# EAGLE schematic permamote (EAGLE 9.5.0)
AUTHOR: NEAL JACKSON; REV: C; TITLE: PERMAMOTE

## Sheet 1 of 5: NRF
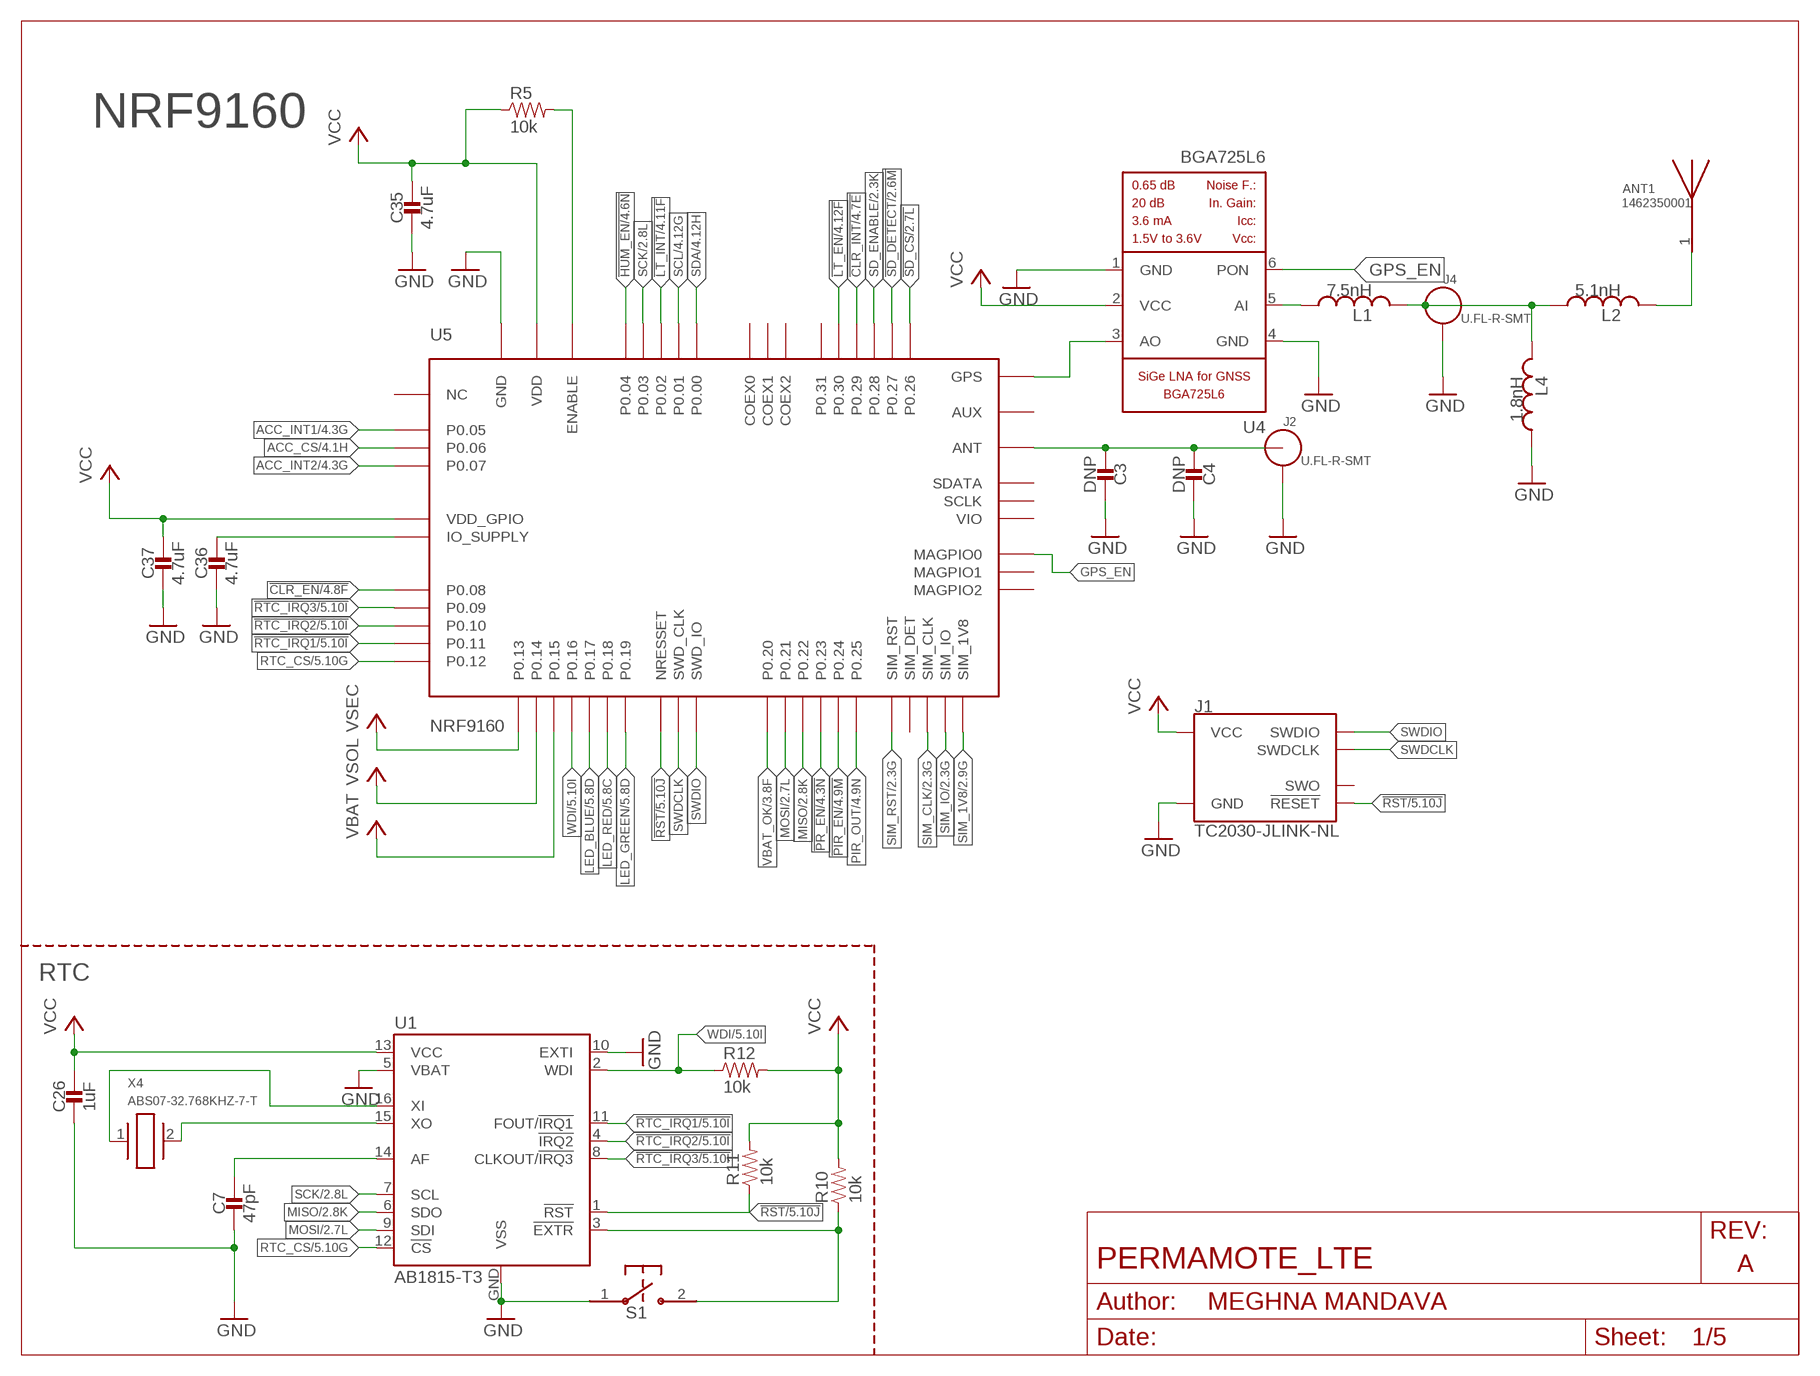
[diagram p0: schematic, sheet 1]
FRAME1 (LETTER_L_BLANK): AUTHOR: MEGHNA MANDAVA; REV: A; TITLE: PERMAMOTE_LTE

### Parts
ANT1  1462350001  [ANT_1462350001]
C3  DNP  CAPACITOR0402_CAP  [0402_CAP]
C4  DNP  CAPACITOR0402_CAP  [0402_CAP]
C7  47pF  CAPACITOR0402_CAP  [0402_CAP]
C26  1uF  CAPACITOR0402_CAP  [0402_CAP]
C35  4.7uF  CAPACITOR0402_CAP  [0402_CAP]
C36  4.7uF  CAPACITOR0402_CAP  [0402_CAP]
C37  4.7uF  CAPACITOR0402_CAP  [0402_CAP]
J1  TC2030-JLINK-NL  [TC2030-IDC-NL]
J2  U.FL-R-SMT  [U.FL_SMT]
J4  U.FL-R-SMT  [U.FL_SMT]
L1  7.5nH  INDUCTOR0402  [0402_CAP]
L2  5.1nH  INDUCTOR0402  [0402_CAP]
L4  1.8nH  INDUCTOR0402  [0402_CAP]
R5  10k  RESISTOR0402_RES  [0402_RES]
R10  10k  RESISTOR0402_RES  [0402_RES]
R11  10k  RESISTOR0402_RES  [0402_RES]
R12  10k  RESISTOR0402_RES  [0402_RES]
S1  B3U-1000P  [B3U-1000P]
U1  AB1815-T3  [QFN-16-3MM]
U4  BGA725L6  [LNA-TSLP-6-2-ORIG]
U5  NRF9160  [NRF9160]
X4  ABS07-32.768KHZ-7-T  [2-SMD]

### Nets
!CLR_EN: U5.P0.08 ; also sheet 4,5
!CLR_INT: U5.P0.29 ; also sheet 4,5
!HUM_EN: U5.P0.04 ; also sheet 4,5
!LT_EN: U5.P0.30 ; also sheet 4,5
!LT_INT: U5.P0.02 ; also sheet 4,5
!PIR_EN: U5.P0.24 ; also sheet 4,5
!PR_EN: U5.P0.23 ; also sheet 4,5
!RST: J1.3(!RESET) R11.1 U1.1(!RST) U5.NRESET(NRESSET) ; also sheet 5
!RTC_EXTR: R10.1 S1.2 U1.3(!EXTR)
!RTC_IRQ1: U1.11(FOUT/!IRQ1) U5.P0.11 ; also sheet 5
!RTC_IRQ2: U1.4(!IRQ2) U5.P0.10 ; also sheet 5
!RTC_IRQ3: U1.8(CLKOUT/!IRQ3) U5.P0.09 ; also sheet 5
!SD_CS: U5.P0.26 ; also sheet 2
!SD_DETECT: U5.P0.27 ; also sheet 2
ACC_CS: U5.P0.06 ; also sheet 4,5
ACC_INT1: U5.P0.05 ; also sheet 4,5
ACC_INT2: U5.P0.07 ; also sheet 4,5
GND: C3.1 C4.1 C7.2 C26.2 C35.2 C36.2 C37.2 J1.5(GND) J2.GND1 J2.GND2 J4.GND1 J4.GND2 L4.1 S1.1 U1.5(VBAT) U1.10(EXTI) U1.GND(VSS) U4.1(GND) U4.4(GND) U5.GND@1(GND) U5.GND@2(GND) U5.GND@3(GND) U5.GND@4(GND) U5.GND@5(GND) U5.GND@6(GND) U5.GND@7(GND) U5.GND@8(GND) U5.GND@9(GND) U5.GND@10(GND) U5.GND@11(GND) U5.GND@12(GND) U5.GND@13(GND) U5.GND@14(GND) U5.GND@15(GND) U5.GND@16(GND) U5.GND@17(GND) U5.GND@18(GND) U5.GND@19(GND) U5.GND@20(GND) U5.GND@21(GND) U5.GND@22(GND) U5.GND@23(GND) U5.GND@24(GND) U5.GND@25(GND) U5.GND@26(GND) U5.GND@27(GND) U5.GND@28(GND) U5.GND@29(GND) U5.GND@30(GND) U5.GND@31(GND) U5.GND@32(GND) U5.GND@33(GND) U5.GND@34(GND) U5.GND@35(GND) U5.GND_SHIELD@1(GND) U5.GND_SHIELD@2(GND) U5.GND_SHIELD@3(GND) U5.GND_SHIELD@4(GND) U5.GND_SHIELD@5(GND) U5.GND_SHIELD@6(GND) U5.GND_SHIELD@7(GND) U5.GND_SHIELD@8(GND) U5.GND_SHIELD@9(GND) U5.GND_SHIELD@10(GND) U5.GND_SHIELD@11(GND) U5.GND_SHIELD@12(GND) U5.GND_SHIELD@13(GND) U5.GND_SHIELD@14(GND) U5.GND_SHIELD@15(GND) U5.GND_SHIELD@16(GND) U5.GND_SHIELD@17(GND) U5.GND_SHIELD@18(GND) U5.GND_SHIELD@19(GND) U5.GND_SHIELD@20(GND) U5.GND_SHIELD@21(GND) U5.GND_SHIELD@22(GND) U5.GND_SHIELD@23(GND) U5.GND_SHIELD@24(GND) U5.GND_SHIELD@25(GND) U5.GND_SHIELD@26(GND) U5.GND_SHIELD@27(GND) U5.GND_SHIELD@28(GND) U5.GND_SHIELD@29(GND) U5.GND_SHIELD@30(GND) U5.GND_SHIELD@31(GND) U5.GND_SHIELD@32(GND) U5.GND_SHIELD@33(GND) U5.GND_SHIELD@34(GND) ; also sheet 2,3,4,5
GPS_EN: U4.6(PON) U5.MAGPIO0
LED_BLUE: U5.P0.17 ; also sheet 5
LED_GREEN: U5.P0.19 ; also sheet 5
LED_RED: U5.P0.18 ; also sheet 5
MISO: U1.6(SDO) U5.P0.22 ; also sheet 2,4,5
MOSI: U1.9(SDI) U5.P0.21 ; also sheet 2,4,5
N$1: U4.3(AO) U5.GPS
N$2: L1.1 U4.5(AI)
N$4: J4.SIG(ANT) L1.2 L2.1 L4.2
N$5: ANT1.1 L2.2
N$8: C3.2 C4.2 J2.SIG(ANT) U5.ANT
N$25: C7.1 U1.14(AF)
N$28: R5.2 U5.ENABLE
N$29: C36.1 U5.IO_SUPPLY
N$40: U1.15(XO) X4.2
N$43: U1.16(XI) X4.1
PIR_OUT: U5.P0.25 ; also sheet 4,5
RTC_CS: U1.12(!CS) U5.P0.12 ; also sheet 5
SCK: U1.7(SCL) U5.P0.03 ; also sheet 2,4,5
SCL: U5.P0.01 ; also sheet 4,5
SD_ENABLE: U5.P0.28 ; also sheet 2
SDA: U5.P0.00 ; also sheet 4,5
SIM_1V8: U5.SIM_1V8 ; also sheet 2
SIM_CLK: U5.SIM_CLK ; also sheet 2
SIM_IO: U5.SIM_IO ; also sheet 2
SIM_RST: U5.SIM_RST ; also sheet 2
SWDCLK: J1.4(SWDCLK) U5.SWDCLK(SWD_CLK)
SWDIO: J1.2(SWDIO) U5.SWDIO(SWD_IO)
VBAT: U5.P0.15 ; also sheet 3
VBAT_OK: U5.P0.20 ; also sheet 3
VCC: C26.1 C35.1 C37.1 J1.1(VCC) R5.1 R10.2 R11.2 R12.2 U1.13(VCC) U4.2(VCC) U5.VDD@1(VDD) U5.VDD@2(VDD) U5.VDD_GPIO ; also sheet 2,3,4,5
VSEC: U5.P0.13 ; also sheet 3
VSOL: U5.P0.14 ; also sheet 3,5
WDI: R12.1 U1.2(WDI) U5.P0.16 ; also sheet 5
Unconnected: J1.6(SWO) U5.AUX U5.COEX0 U5.COEX1 U5.COEX2 U5.MAGPIO1 U5.MAGPIO2 U5.NC1(NC) U5.NC2(NC) U5.NC3(NC) U5.NC4(NC) U5.NC5(NC) U5.NC6(NC) U5.NC7(NC) U5.NC8(NC) U5.NC9(NC) U5.NC10(NC) U5.NC11(NC) U5.NC12(NC) U5.NC13(NC) U5.NC14(NC) U5.NC15(NC) U5.NC16(NC) U5.NC17(NC) U5.NC18(NC) U5.NC19(NC) U5.NC20(NC) U5.NC21(NC) U5.NC22(NC) U5.NC23(NC) U5.NC24(NC) U5.NC25(NC) U5.NC26(NC) U5.NC27(NC) U5.NC28(NC) U5.NC29(NC) U5.NC30(NC) U5.NC31(NC) U5.NC32(NC) U5.NC33(NC) U5.NC34(NC) U5.NC35(NC) U5.P0.31 U5.SCLK U5.SDATA U5.SIM_DET U5.VIO

### Notes on the sheet
- NRF9160
- RTC

## Sheet 2 of 5: SIM and SD
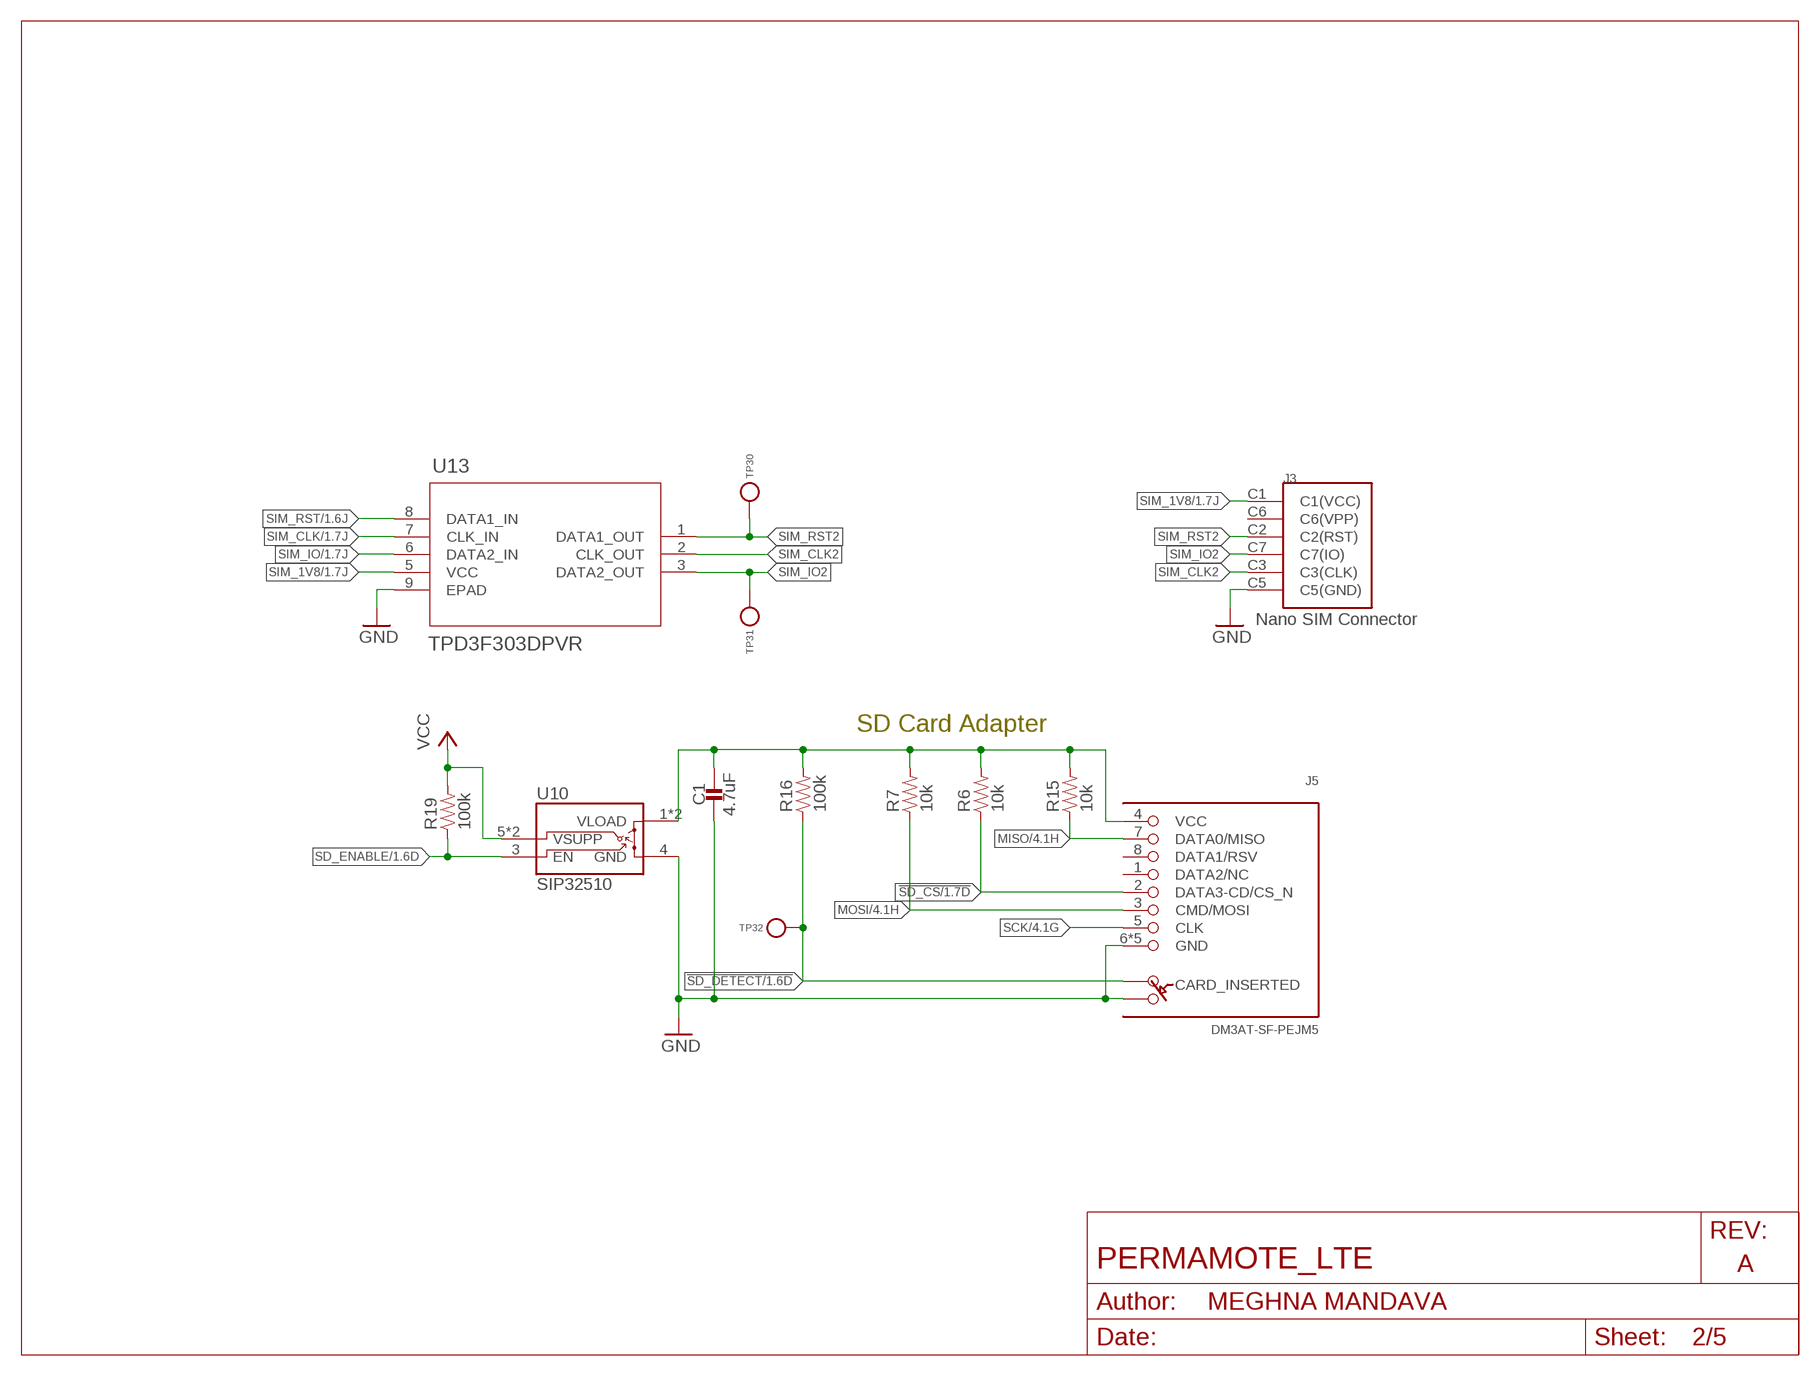
[diagram p1: schematic, sheet 2]
FRAME4 (LETTER_L_BLANK): AUTHOR: MEGHNA MANDAVA; REV: A; TITLE: PERMAMOTE_LTE

### Parts
C1  4.7uF  CAPACITOR0402_CAP  [0402_CAP]
J3  NANO_SIM  [WURTH_NANO_SIM]
J5  DM3AT-SF-PEJM5  [DM3AT-SF-PEJM5]
R6  10k  RESISTOR0402_RES  [0402_RES]
R7  10k  RESISTOR0402_RES  [0402_RES]
R15  10k  RESISTOR0402_RES  [0402_RES]
R16  100k  RESISTOR0402_RES  [0402_RES]
R19  100k  RESISTOR0402_RES  [0402_RES]
TP30  TEST-POINT  [PAD.03X.03]
TP31  TEST-POINT  [PAD.03X.03]
TP32  TEST-POINT  [PAD.03X.03]
U10  SIP32510  [TSOT23-6]
U13  TPD3F303DPVR  [DPV8_1P7X0P4]

### Nets
!SD_CS: J5.2(DATA3-CD/CS_N) R6.1 ; also sheet 1
!SD_DETECT: J5.A R16.1 TP32.P$1(TESTPOINT) ; also sheet 1
GND: C1.2 J3.C5(C5(GND)) J5.6(GND) J5.B J5.MOUNT0(GND) J5.MOUNT1(GND) J5.MOUNT2(GND) J5.MOUNT3(GND) U10.4(GND) U13.9(EPAD) ; also sheet 1,3,4,5
MISO: J5.7(DATA0/MISO) R15.1 ; also sheet 1,4,5
MOSI: J5.3(CMD/MOSI) R7.1 ; also sheet 1,4,5
N$13: C1.1 J5.4(VCC) R6.2 R7.2 R15.2 R16.2 U10.1(VLOAD) U10.2(VLOAD)
SCK: J5.5(CLK) ; also sheet 1,4,5
SD_ENABLE: R19.1 U10.3(EN) ; also sheet 1
SIM_1V8: J3.C1(C1(VCC)) U13.5(VCC) ; also sheet 1
SIM_CLK: U13.7(CLK_IN) ; also sheet 1
SIM_CLK2: J3.C3(C3(CLK)) U13.2(CLK_OUT)
SIM_IO: U13.6(DATA2_IN) ; also sheet 1
SIM_IO2: J3.C7(C7(IO)) TP31.P$1(TESTPOINT) U13.3(DATA2_OUT)
SIM_RST: U13.8(DATA1_IN) ; also sheet 1
SIM_RST2: J3.C2(C2(RST)) TP30.P$1(TESTPOINT) U13.1(DATA1_OUT)
VCC: R19.2 U10.5(VSUPP) U10.6(VSUPP) ; also sheet 1,3,4,5
Unconnected: J3.C6(C6(VPP)) J5.1(DATA2/NC) J5.8(DATA1/RSV)

### Notes on the sheet
- SD Card Adapter

## Sheet 3 of 5: Power supply
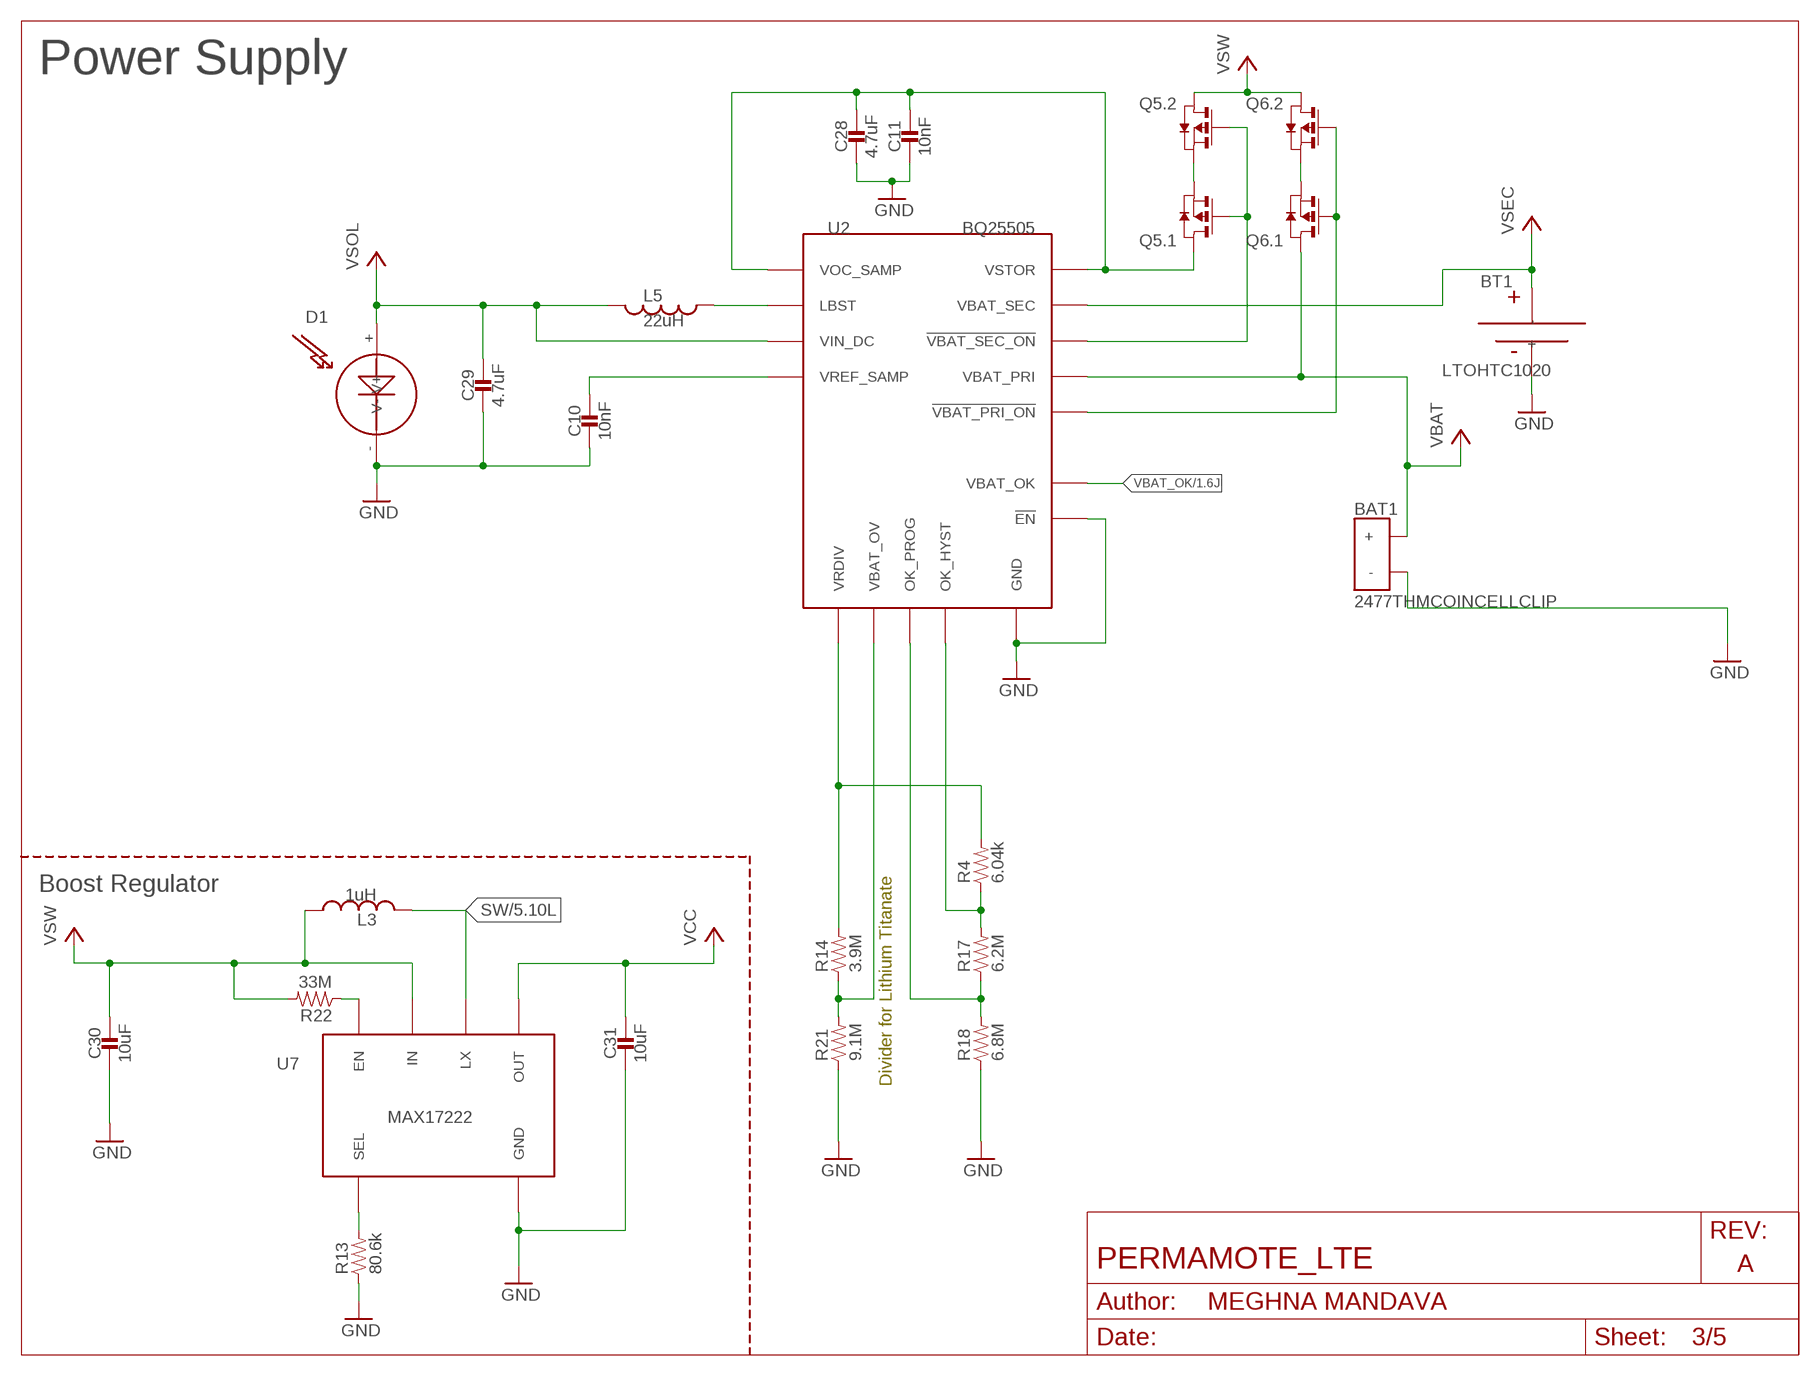
[diagram p2: schematic, sheet 3]
FRAME2 (LETTER_L_BLANK): AUTHOR: MEGHNA MANDAVA; REV: A; TITLE: PERMAMOTE_LTE

### Parts
BAT1  2477THMCOINCELLCLIP  [2477THMCOINCLIP]
BT1  LTOHTC1020  [1020]
C10  10nF  CAPACITOR0402_CAP  [0402_CAP]
C11  10nF  CAPACITOR0402_CAP  [0402_CAP]
C28  4.7uF  CAPACITOR0402_CAP  [0402_CAP]
C29  4.7uF  CAPACITOR0402_CAP  [0402_CAP]
C30  10uF  CAPACITOR0603_CAP  [0603_CAP]
C31  10uF  CAPACITOR0603_CAP  [0603_CAP]
D1  SOLARCELLHOLES  [SOLAR_HOLES]
L3  1uH  INDUCTORIHL  [IHL-1212BZ-11]
L5  22uH  INDUCTOR74437324220  [74437324220]
Q5  PMDXB950UPEL  [XDFN-6]
Q6  PMDXB950UPEL  [XDFN-6]
R4  6.04k  RESISTOR0402_RES  [0402_RES]
R13  80.6k  RESISTOR0603_RES  [0603-RES]
R14  3.9M  RESISTOR0402_RES  [0402_RES]
R17  6.2M  RESISTOR0402_RES  [0402_RES]
R18  6.8M  RESISTOR0402_RES  [0402_RES]
R21  9.1M  RESISTOR0402_RES  [0402_RES]
R22  33M  RESISTOR0603_RES  [0603-RES]
U2  BQ25505  [S-PVQFN-N20-RGR]
U7  MAX17222  [UDFN-6-MAXIM]

### Nets
!VBAT_PRI_ON: Q6.2(.1:G) Q6.5(.2:G) U2.10(!VBAT_PRI_ON)
!VBAT_SEC_ON: Q5.2(.1:G) Q5.5(.2:G) U2.9(!VBAT_SEC_ON)
GND: BAT1.GND(-) BT1.- C10.2 C11.2 C28.2 C29.2 C30.2 C31.2 D1.-(V-) R13.1 R18.1 R21.1 U2.1(GND) U2.5(!EN) U2.6(GND) U2.15(GND) U2.16(GND) U2.17(GND) U2.PAD(GND) U7.3(GND) ; also sheet 1,2,4,5
LBST: L5.P$1 U2.20(LBST)
N$12: R13.2 U7.4(SEL)
N$14: R22.1 U7.6(EN)
N$18: R14.1 R21.2 U2.7(VBAT_OV)
N$32: R4.2 R14.2 U2.8(VRDIV)
N$45: Q5.1(.1:S) Q5.4(.2:S)
N$53: Q6.1(.1:S) Q6.4(.2:S)
N$57: R17.1 R18.2 U2.12(OK_PROG)
N$58: R4.1 R17.2 U2.11(OK_HYST)
SW: L3.P$2 U7.2(LX) ; also sheet 5
VBAT: BAT1.1(+) BAT1.2(+) Q6.6(.1:D) U2.14(VBAT_PRI) ; also sheet 1
VBAT_OK: U2.13(VBAT_OK) ; also sheet 1
VCC: C31.1 U7.1(OUT) ; also sheet 1,2,4,5
VOC_SAMP_VSTOR: C11.1 C28.1 Q5.6(.1:D) U2.3(VOC_SAMP) U2.19(VSTOR)
VREF_SAMP: C10.1 U2.4(VREF_SAMP)
VSEC: BT1.+ U2.18(VBAT_SEC) ; also sheet 1
VSOL: C29.1 D1.+(V+) L5.P$2 U2.2(VIN_DC) ; also sheet 1,5
VSW: C30.1 L3.P$1 Q5.3(.2:D) Q6.3(.2:D) R22.2 U7.5(IN)

### Notes on the sheet
- Power Supply
- Boost Regulator
- Divider for Lithium Titanate

## Sheet 4 of 5: Sensors
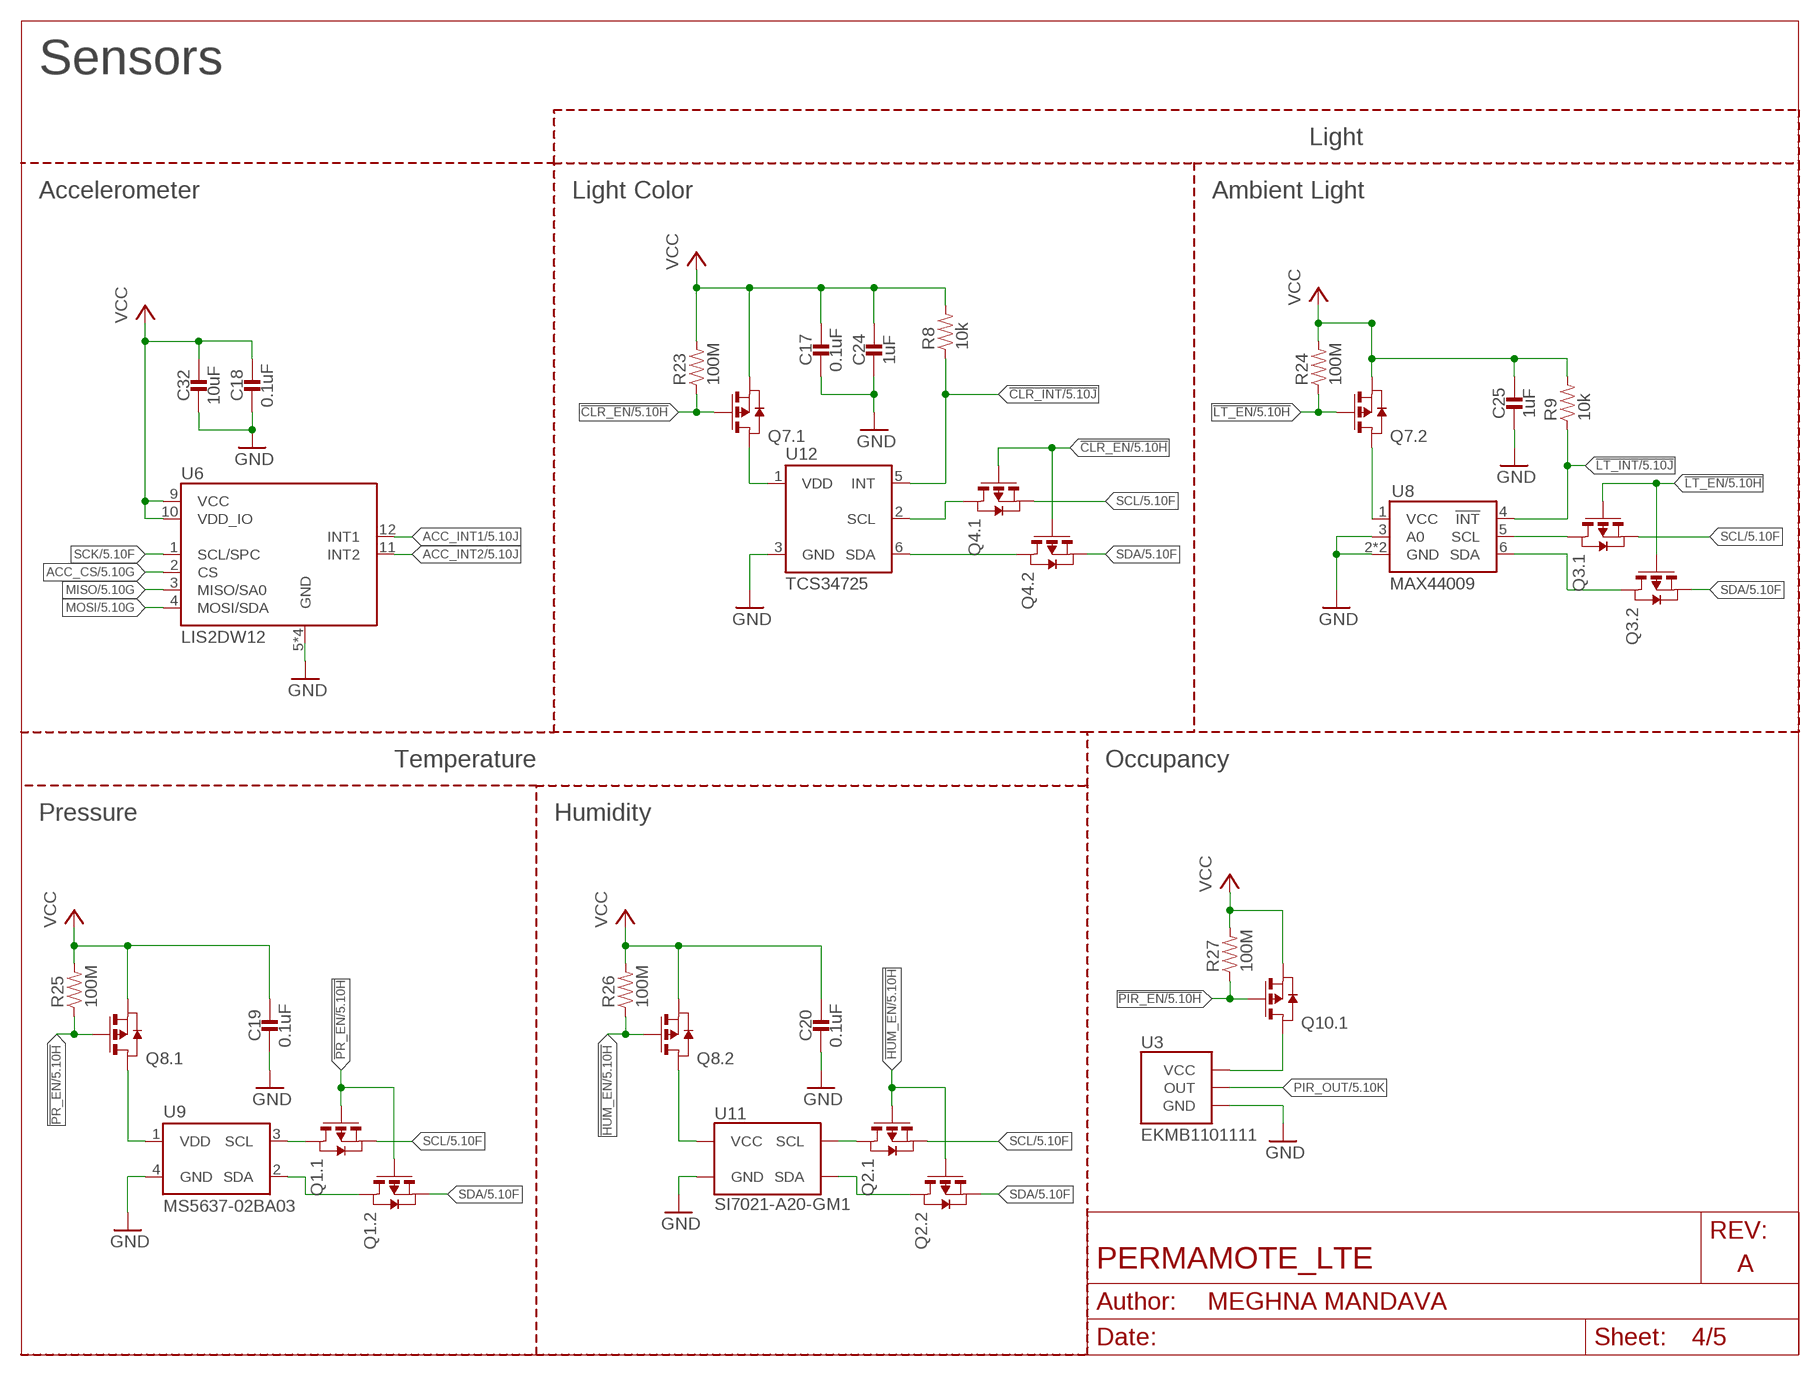
[diagram p3: schematic, sheet 4]
FRAME3 (LETTER_L_BLANK): AUTHOR: MEGHNA MANDAVA; REV: A; TITLE: PERMAMOTE_LTE

### Parts
C17  0.1uF  CAPACITOR0402_CAP  [0402_CAP]
C18  0.1uF  CAPACITOR0402_CAP  [0402_CAP]
C19  0.1uF  CAPACITOR0402_CAP  [0402_CAP]
C20  0.1uF  CAPACITOR0402_CAP  [0402_CAP]
C24  1uF  CAPACITOR0402_CAP  [0402_CAP]
C25  1uF  CAPACITOR0402_CAP  [0402_CAP]
C32  10uF  CAPACITOR0603_CAP  [0603_CAP]
Q1  PMDXB950UPEL  [XDFN-6]
Q2  PMDXB950UPEL  [XDFN-6]
Q3  PMDXB950UPEL  [XDFN-6]
Q4  PMDXB950UPEL  [XDFN-6]
Q7  PMDXB950UPEL  [XDFN-6]
Q8  PMDXB950UPEL  [XDFN-6]
Q10  PMDXB950UPEL  [XDFN-6]
R8  10k  RESISTOR0402_RES  [0402_RES]
R9  10k  RESISTOR0402_RES  [0402_RES]
R23  100M  RESISTOR0402_RES  [0402_RES]
R24  100M  RESISTOR0402_RES  [0402_RES]
R25  100M  RESISTOR0402_RES  [0402_RES]
R26  100M  RESISTOR0402_RES  [0402_RES]
R27  100M  RESISTOR0402_RES  [0402_RES]
U3  EKMB1101111  [AMN2]
U6  LIS2DW12  [LGA-12]
U8  MAX44009  [UDFN-6-EXPOSED]
U9  MS5637-02BA03  [4-SMD]
U11  SI7021-A20-GM1  [DFN-6/3MM]
U12  TCS34725  [FN-6]

### Nets
!CLR_EN: Q4.2(.1:G) Q4.5(.2:G) Q7.2(.1:G) R23.1 ; also sheet 1,5
!CLR_INT: R8.1 U12.5(INT) ; also sheet 1,5
!HUM_EN: Q2.2(.1:G) Q2.5(.2:G) Q8.5(.2:G) R26.1 ; also sheet 1,5
!LT_EN: Q3.2(.1:G) Q3.5(.2:G) Q7.5(.2:G) R24.1 ; also sheet 1,5
!LT_INT: R9.1 U8.4(!INT) ; also sheet 1,5
!PIR_EN: Q10.2(.1:G) R27.1 ; also sheet 1,5
!PR_EN: Q1.2(.1:G) Q1.5(.2:G) Q8.2(.1:G) R25.1 ; also sheet 1,5
ACC_CS: U6.2(CS) ; also sheet 1,5
ACC_INT1: U6.12(INT1) ; also sheet 1,5
ACC_INT2: U6.11(INT2) ; also sheet 1,5
GND: C17.2 C18.2 C19.2 C20.2 C24.2 C25.2 C32.2 U3.GND U6.5(GND) U6.6(GND) U6.7(GND) U6.8(GND) U8.2(GND) U8.3(A0) U8.EP(GND) U9.4(GND) U11.2(GND) U12.3(GND) ; also sheet 1,2,3,5
MISO: U6.3(MISO/SA0) ; also sheet 1,2,5
MOSI: U6.4(MOSI/SDA) ; also sheet 1,2,5
N$20: Q7.3(.2:D) U8.1(VCC)
N$21: Q8.6(.1:D) U9.1(VDD)
N$22: Q8.3(.2:D) U11.5(VCC)
N$23: Q10.6(.1:D) U3.VCC
N$31: Q7.6(.1:D) U12.1(VDD)
N$34: Q1.6(.1:D) U9.3(SCL)
N$41: Q1.3(.2:D) U9.2(SDA)
N$48: Q2.3(.2:D) U11.1(SDA)
N$50: Q2.6(.1:D) U11.6(SCL)
N$51: Q3.3(.2:D) U8.6(SDA)
N$52: Q3.6(.1:D) U8.5(SCL)
N$54: Q4.3(.2:D) U12.6(SDA)
N$55: Q4.6(.1:D) U12.2(SCL)
PIR_OUT: U3.OUT ; also sheet 1,5
SCK: U6.1(SCL/SPC) ; also sheet 1,2,5
SCL: Q1.1(.1:S) Q2.1(.1:S) Q3.1(.1:S) Q4.1(.1:S) ; also sheet 1,5
SDA: Q1.4(.2:S) Q2.4(.2:S) Q3.4(.2:S) Q4.4(.2:S) ; also sheet 1,5
VCC: C17.1 C18.1 C19.1 C20.1 C24.1 C25.1 C32.1 Q7.1(.1:S) Q7.4(.2:S) Q8.1(.1:S) Q8.4(.2:S) Q10.1(.1:S) R8.2 R9.2 R23.2 R24.2 R25.2 R26.2 R27.2 U6.9(VCC) U6.10(VDD_IO) ; also sheet 1,2,3,5
Unconnected: Q10.3(.2:D) Q10.4(.2:S) Q10.5(.2:G)

### Notes on the sheet
- Sensors
- Light
- Accelerometer | Light Color | Ambient Light
- Temperature | Occupancy
- Pressure | Humidity

## Sheet 5 of 5: Debugging
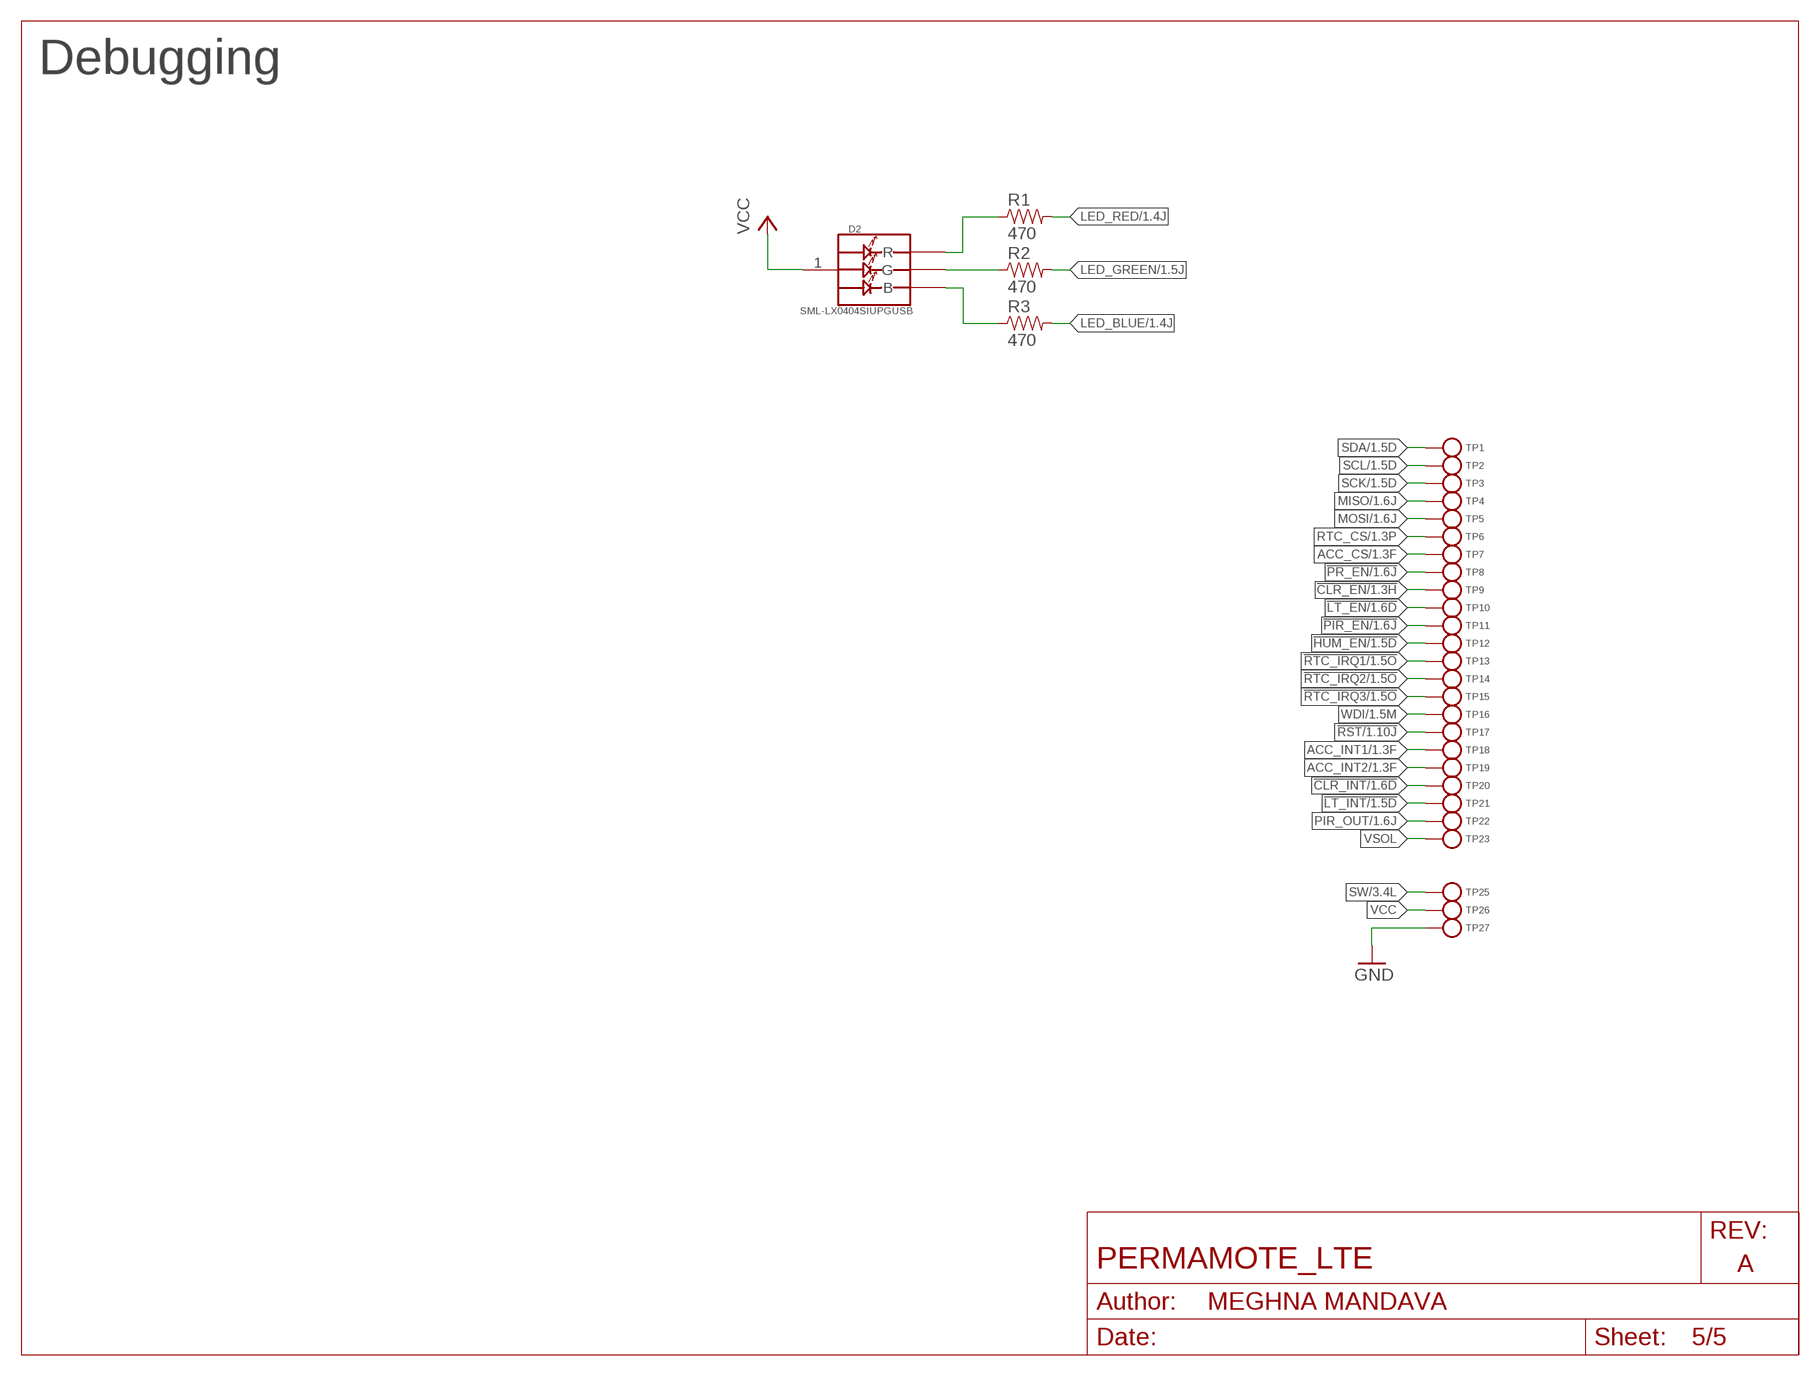
[diagram p4: schematic, sheet 5]
FRAME5 (LETTER_L_BLANK): AUTHOR: MEGHNA MANDAVA; REV: A; TITLE: PERMAMOTE_LTE

### Parts
D2  SML-LX0404SIUPGUSB  [1MM_SQ_4PAD]
R1  470  RESISTOR0402_RES  [0402_RES]
R2  470  RESISTOR0402_RES  [0402_RES]
R3  470  RESISTOR0402_RES  [0402_RES]
TP1  TEST-POINT  [PAD.03X.03]
TP2  TEST-POINT  [PAD.03X.03]
TP3  TEST-POINT  [PAD.03X.03]
TP4  TEST-POINT  [PAD.03X.03]
TP5  TEST-POINT  [PAD.03X.03]
TP6  TEST-POINT  [PAD.03X.03]
TP7  TEST-POINT  [PAD.03X.03]
TP8  TEST-POINT  [PAD.03X.03]
TP9  TEST-POINT  [PAD.03X.03]
TP10  TEST-POINT  [PAD.03X.03]
TP11  TEST-POINT  [PAD.03X.03]
TP12  TEST-POINT  [PAD.03X.03]
TP13  TEST-POINT  [PAD.03X.03]
TP14  TEST-POINT  [PAD.03X.03]
TP15  TEST-POINT  [PAD.03X.03]
TP16  TEST-POINT  [PAD.03X.03]
TP17  TEST-POINT  [PAD.03X.03]
TP18  TEST-POINT  [PAD.03X.03]
TP19  TEST-POINT  [PAD.03X.03]
TP20  TEST-POINT  [PAD.03X.03]
TP21  TEST-POINT  [PAD.03X.03]
TP22  TEST-POINT  [PAD.03X.03]
TP23  TEST-POINT  [PAD.03X.03]
TP25  TEST-POINT  [PAD.03X.03]
TP26  TEST-POINT  [PAD.03X.03]
TP27  TEST-POINT  [PAD.03X.03]

### Nets
!CLR_EN: TP9.P$1(TESTPOINT) ; also sheet 1,4
!CLR_INT: TP20.P$1(TESTPOINT) ; also sheet 1,4
!HUM_EN: TP12.P$1(TESTPOINT) ; also sheet 1,4
!LT_EN: TP10.P$1(TESTPOINT) ; also sheet 1,4
!LT_INT: TP21.P$1(TESTPOINT) ; also sheet 1,4
!PIR_EN: TP11.P$1(TESTPOINT) ; also sheet 1,4
!PR_EN: TP8.P$1(TESTPOINT) ; also sheet 1,4
!RST: TP17.P$1(TESTPOINT) ; also sheet 1
!RTC_IRQ1: TP13.P$1(TESTPOINT) ; also sheet 1
!RTC_IRQ2: TP14.P$1(TESTPOINT) ; also sheet 1
!RTC_IRQ3: TP15.P$1(TESTPOINT) ; also sheet 1
ACC_CS: TP7.P$1(TESTPOINT) ; also sheet 1,4
ACC_INT1: TP18.P$1(TESTPOINT) ; also sheet 1,4
ACC_INT2: TP19.P$1(TESTPOINT) ; also sheet 1,4
GND: TP27.P$1(TESTPOINT) ; also sheet 1,2,3,4
LED_BLUE: R3.2 ; also sheet 1
LED_GREEN: R2.2 ; also sheet 1
LED_RED: R1.2 ; also sheet 1
MISO: TP4.P$1(TESTPOINT) ; also sheet 1,2,4
MOSI: TP5.P$1(TESTPOINT) ; also sheet 1,2,4
N$15: D2.2(R) R1.1
N$17: D2.4(G) R2.1
N$19: D2.3(B) R3.1
PIR_OUT: TP22.P$1(TESTPOINT) ; also sheet 1,4
RTC_CS: TP6.P$1(TESTPOINT) ; also sheet 1
SCK: TP3.P$1(TESTPOINT) ; also sheet 1,2,4
SCL: TP2.P$1(TESTPOINT) ; also sheet 1,4
SDA: TP1.P$1(TESTPOINT) ; also sheet 1,4
SW: TP25.P$1(TESTPOINT) ; also sheet 3
VCC: D2.1(VDD) TP26.P$1(TESTPOINT) ; also sheet 1,2,3,4
VSOL: TP23.P$1(TESTPOINT) ; also sheet 1,3
WDI: TP16.P$1(TESTPOINT) ; also sheet 1

### Notes on the sheet
- Debugging

## Library data of the parts
ANT1 = chips:1462350001: Antenna GPS 1.4dBi Gain 1578MHz SMD T/R; DESCRIPTION: Antenna GPS 1.4dBi Gain 1578MHz SMD T/R; DIGI-KEY_PART_NUMBER: WM15009CT-ND; DIGI-KEY_PURCHASE_URL: https://www.digikey.com/product-detail/en/molex/1462350001/WM15009CT-ND/6159255?utm_source=snapeda&utm_medium=aggregator&utm_campaign=symbol; MF: Molex; MP: 1462350001; PACKAGE: None
BAT1 = batteries:2477THMCOINCELLCLIP: Battery clip for 2477 Coin Cell; DIGIKEY: 36-3039-ND; MANUFACTURER: Keystone; MPN: 3039
BT1 = batteries:LTOHTC
C1 = passives:CAPACITOR: SMD Capacitor; DESCRIPTION: CAP CER 4.7UF 10V X5R 0402; DIGIKEY: 1276-1480-1-ND; MANUFACTURER: Samsung Electro-Mechanics; MPN: CL05A475KP5NRNC
C3 C4 = passives:CAPACITOR: SMD Capacitor
C7 = passives:CAPACITOR: SMD Capacitor; DIGIKEY: 490-5942-1-ND; MPN: GRM1555C1H470JA01D
C10 C11 = passives:CAPACITOR: SMD Capacitor; DIGIKEY: 490-4516-1-ND; MPN: GRM155R71H103KA88D
C17-C20 = passives:CAPACITOR: SMD Capacitor; DIGIKEY: 490-6328-1-ND; MPN: GRM155R71C104KA88J
C24-C26 = passives:CAPACITOR: SMD Capacitor; DIGIKEY: 490-7195-1-ND; MPN: GRM155R70G105KA12D
C28 C29 C35-C37 = passives:CAPACITOR: SMD Capacitor; DIGIKEY: 445-5947-1-ND; MPN: C1005X5R0J475K050BC
C30-C32 = passives:CAPACITOR: SMD Capacitor; DIGIKEY: 490-3896-1-ND; MPN: GRM188R60J106ME47D
D1 = permamote:SOLARCELL: Generic solar cell; DIGIKEY: 869-1001-ND; MPN: AM-1454CA
D2 = leds:SML-LX0404SIUPGUSB: 1mm^2 RGB LED; DIGIKEY: 67-2125-1-ND; MANUFACTURER: Lumex Opto; MPN: SML-LX0404SIUPGUSB
J1 = connector:TC2030-JLINK
J2 J4 = connector:U.FL-R-SMT: U.FL-R-SMT Antenna Connector; DIGIKEY: H122041-ND; MANUFACTURER: Hirose; MPN: U.FL-R-SMT-1(01)
J3 = signpost:NANO_SIM: WURTH Nano SIM Connector; DIGIKEY: 732-5954-1-ND; MANUFACTURER: Wurth; MPN: 693043020611
J5 = connector:DM3AT-SF-PEJM5: CONN MICRO SD R/A PUSH-PUSH SMD; DESCRIPTION: CONN MICRO SD CARD PUSH-PUSH R/A; DIGIKEY: HR1964CT-ND; MANUFACTURER: Hirose Electric Co Ltd; MPN: DM3AT-SF-PEJM5
L1 L2 L4 = passives:INDUCTOR: A very specific inductor
L3 = passives:INDUCTOR: A very specific inductor; DIGIKEY: 541-1319-1-ND; MANUFACTURER: Vishay Dale; MPN: IHLP1212BZER1R0M11
L5 = passives:INDUCTOR: A very specific inductor; DIGIKEY: 732-3340-1-ND; MPN: 74437324220
Q1-Q8 Q10 = fets:PMDXB950UPEL: 20 V 500mA, dual P-channel Trench MOSFET; DIGIKEY: 1727-2601-1-ND; MANUFACTURER: NEXPERIA; MPN: PMDXB950UPELZ
R1-R3 = passives:RESISTOR: Resistor Basic schematic elements and footprints for 0201, 0402, 0603, 1206, and PTH resistors.; DIGIKEY: 311-470JRCT-ND; MPN: RC0402JR-07470RL
R4 = passives:RESISTOR: Resistor Basic schematic elements and footprints for 0201, 0402, 0603, 1206, and PTH resistors.; DIGIKEY: YAG2293CT-ND; MPN: RC0402FR-076K04L
R5 R8-R12 = passives:RESISTOR: Resistor Basic schematic elements and footprints for 0201, 0402, 0603, 1206, and PTH resistors.; DIGIKEY: 311-10KJRCT-ND; MPN: RC0402JR-0710KL
R6 R7 R15 = passives:RESISTOR: Resistor Basic schematic elements and footprints for 0201, 0402, 0603, 1206, and PTH resistors.; DESCRIPTION: RES SMD 10K OHM 1% 1/16W 0402; DIGIKEY: 1276-3431-1-ND; MANUFACTURER: Samsung Electro-Mechanics; MPN: RC1005F103CS
R13 = passives:RESISTOR: Resistor Basic schematic elements and footprints for 0201, 0402, 0603, 1206, and PTH resistors.; DIGIKEY: 311-80.6KHRCT-ND; MPN: RC0603FR-0780K6L
R14 = passives:RESISTOR: Resistor Basic schematic elements and footprints for 0201, 0402, 0603, 1206, and PTH resistors.; DIGIKEY: YAG3301CT-ND; MPN: RC0402JR-073M9L
R16 R19 = passives:RESISTOR: Resistor Basic schematic elements and footprints for 0201, 0402, 0603, 1206, and PTH resistors.; DESCRIPTION: RES SMD 100K OHM 1% 1/5W 0402; DIGIKEY: 541-100KYCT-ND; MANUFACTURER: Vishay Dale; MPN: CRCW0402100KFKEDHP
R17 = passives:RESISTOR: Resistor Basic schematic elements and footprints for 0201, 0402, 0603, 1206, and PTH resistors.; DIGIKEY: YAG3309CT-ND; MPN: RC0402JR-076M2L
R18 = passives:RESISTOR: Resistor Basic schematic elements and footprints for 0201, 0402, 0603, 1206, and PTH resistors.; DIGIKEY: YAG3310CT-ND; MPN: RC0402JR-076M8L
R21 = passives:RESISTOR: Resistor Basic schematic elements and footprints for 0201, 0402, 0603, 1206, and PTH resistors.; DIGIKEY: YAG3322CT-ND; MPN: RC0402JR-079M1L
R22 = passives:RESISTOR: Resistor Basic schematic elements and footprints for 0201, 0402, 0603, 1206, and PTH resistors.; DIGIKEY: HMC0603JT33M0CT-ND; MPN: HMC0603JT33M0
R23-R27 = passives:RESISTOR: Resistor Basic schematic elements and footprints for 0201, 0402, 0603, 1206, and PTH resistors.; DIGIKEY: 541-100MAHCT-ND; MPN: HMC0402JT100M
S1 = switches:B3U: Switch; DIGIKEY: SW1020CT-ND; MANUFACTURER: Omron; MPN: B3U-1000P
TP1-TP23 TP25-TP27 TP30-TP32 = headers:TEST-POINT
U1 = chips:AB1815-T3: Ultra-low current RTC. 55nA quiescent @ 3V. 1.5-3.6V input.; DIGIKEY: 535-11936-1-ND; MANUFACTURER: Abracon; MPN: AB1815-T3
U2 = chips:BQ25505: EH front end for switching between primary and secondary cells; DIGIKEY: 296-37078-1-ND; MANUFACTURER: TI; MPN: BQ25505RGRR
U3 = chips:EKMB: Passive infrared human detection sensor with built-in amp.; DIGIKEY: 255-3065-ND; MANUFACTURER: PANASONIC; MPN: EKMB1101111
U4 = chips:BGA725L6
U5 = chips:NRF9160
U6 = chips:LIS2DW12: ultra low power 3 axis accelerometer; DIGIKEY: 497-17718-6-ND; MANUFACTURER: STMicroelectronics; MOUSER: 511-LIS2DW12TR; MPN: LIS2DW12TR
U7 = chips:MAX17222: Very high efficiency, very low power boost converter suitable for EH applications; DIGIKEY: MAX17222ELT+TCT-ND; MANUFACTURER: MAXIM INTEGRATED; MPN: MAX17222ELT+T
U8 = chips:MAX44009: low power ambient light sensor; DIGIKEY: MAX44009EDT+TCT-ND; MANUFACTURER: MAXIM; MPN: MAX44009EDT+T
U9 = chips:MS5637-02BA03: low power pressure sensor; DIGIKEY: 223-1199-1-ND; MANUFACTURER: TE CONNECTIVITY; MPN: MS563702BA03-50
U10 = chips:SIP32510: Load switch, slew rate controlled. By Vishay; DESCRIPTION: IC LOAD SWITCH SOT23-6; DIGIKEY: SIP32510DT-T1-GE3CT-ND; MANUFACTURER: Vishay; MPN: SIP32510DT-T1-GE3
U11 = chips:SI7021: IC TEMP SENSOR RH 2% DFN; DIGIKEY: 336-3141-ND; MOUSER: 634-SI7021-A20-GM1; MPN: SI7021-A20-GM1
U12 = chips:TCS34725: Color Light-to-Digital Converter with IR Filter; DIGIKEY: TCS34725FNCT-ND; MPN: TCS34725FN
U13 = chips:TPD3F303DPVR; MANUFACTURER_PART_NUMBER: TPD3F303DPVR; VENDOR: Texas Instruments
X4 = crystals:ABS07-32.768KHZ: 32.768kHz Crystal; DIGIKEY: 535-9543-1-ND; MANUFACTURER: ABRACON; MPN: ABS07-32.768KHZ-7-T